# Altium project Automated Plant Watering System.PrjPcb
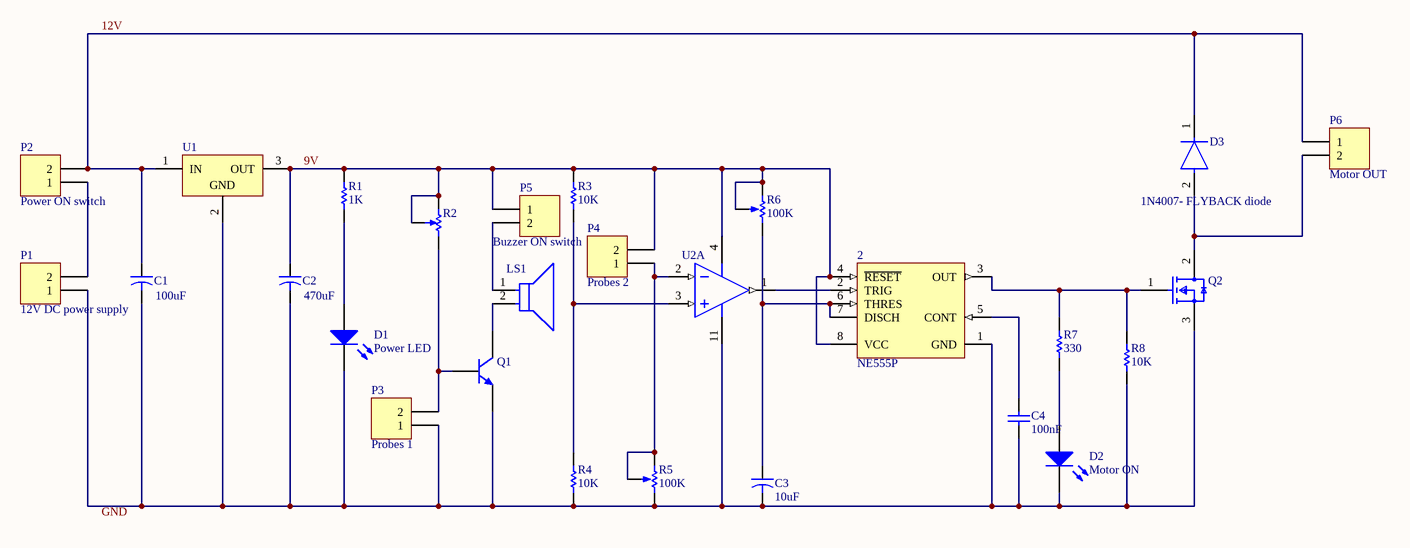
[diagram p0: Automated Plant Watering System Schematic.SchDoc]
1 sheet, 27 parts. Net scope: global (net labels, ports and power ports of the same name join across sheets).
Board file: Automated Plant Watering PCB.PcbDoc

## Sheet Automated Plant Watering System Schematic.SchDoc: Automated Plant Watering System
size A4; SheetNumber: 1; SheetTotal: 1; SPICEModelCacheCQLGJPCW: <root> / <DocumentId>CQLGJPCW</DocumentId> / <CacheFrame Number="0"> / <Model Name="led1" Kind="MDL"> / <Text>*Typ RED GaAs LED: Vf=1.7V Vr=4V If=40mA trr=3uS / *LED Pinout: 1=A, 2=K / .MODEL LED1 D (IS=93.2P RS=42M N=3.73 BV=4 IBV=10U / + CJO=2.97P VJ=.75 M=.333 TT=4.32U)</Text> / </Model> / <Model Name="npn" Kind="MDL"> / <Text>*Default NPN BJT / *NPN Trans Pinout: C,B,E / .MODEL NPN NPN()</Text> / </Model> / </CacheFrame> / </root>

### Parts
2  NE555P  [P0008A]
C1  100uF  [CAPR5-4X5]
C2  470uF  [CAPR5-4X5]
C3  10uF  [CAPR5-4X5]
C4  100nF  [RAD-0.3]
D1  Power LED  [LED-1]
D2  Motor ON  [LED-1]
D3  1N4007- FLYBACK diode  [FP-1N4007-MFG]
LS1  AI-1223-TWT-5V-R  [FP-AI-1223-TWT-5V-R-MFG]  (value not drawn)
P1  12V DC power supply  [HDR1X2]
P2  Power ON switch  [HDR1X2]
P3  Probes 1  [HDR1X2]
P4  Probes 2  [HDR1X2]
P5  Buzzer ON switch  [HDR1X2]
P6  Motor OUT  [HDR1X2]
Q1  NPN  [TO-226-AA]  (value not drawn)
Q2  FQP30N06  [FP-340AT-MFG]  (value not drawn)
R1  1K  [AXIAL-0.3]
R2  93PR1KLF  [BIT-93PR1KLF]  (value not drawn)
R3  10K  [AXIAL-0.3]
R4  10K  [AXIAL-0.3]
R5  100K  [VR5]
R6  100K  [VR5]
R7  330  [AXIAL-0.3]
R8  10K  [AXIAL-0.3]
U1  L7809CV  [TO220]  (value not drawn)
U2  LM324AN  [N0014A]  (value not drawn)  (part A of 4)

### Nets
9V: 2.4(~{RESET}) 2.8(VCC) C2.1 P4.2 P5.1 R1.2 R2.1 R2.2 R3.2 R6.1(TOP) R6.3(TAP) U1.3(OUT) U2.4(V+)
12V: C1.1 D3.1(C) P2.2 P6.1 U1.1(IN)
Net2_1: 2.1(GND) C1.2 C2.2 C3.2 C4.1 D1.2(K) D2.2(K) P1.1 P3.1 Q1.3(E) Q2.3(S) R4.1 R5.2(BOT) R8.1 U1.2(GND) U2.11(GND)
Net2_2: 2.2(TRIG) U2.1(OUT1)
Net2_3: 2.3(OUT) Q2.1(G) R7.2 R8.2
Net2_5: 2.5(CONT) C4.2
Net2_6: 2.6(THRES) 2.7(DISCH) C3.1 R6.2(BOT)
NetD1_1: D1.1(A) R1.1
NetD2_1: D2.1(A) R7.1
NetD3_2: D3.2(A) P6.2 Q2.2(D)
NetLS1_1: LS1.1(C) P5.2
NetLS1_2: LS1.2(A) Q1.1(C)
NetP1_2: P1.2 P2.1
NetP3_2: P3.2 Q1.2(B) R2.3
NetP4_1: P4.1 R5.1(TOP) R5.3(TAP) U2.2(IN1-)
NetR3_1: R3.1 R4.2 U2.3(IN1+)

### Notes on the sheet
- Labels drawn without touching a wire or pin: GND

### Library data of the parts
2 = CMP-001-0003-1: IC OSC SINGLE TIMER 100KHZ 8-DIP
C1-C3 = Cap2: Capacitor; Published: 23-Sep-2002; PackageReference: CAPR5-4X5; Publisher: Altium Limited; PackageDescription: Capacitor; 2 Leads
  C1: Value: 100uF
  C2: Value: 470uF
  C3: Value: 10uF
C4 = Cap: Capacitor; Published: 8-Jun-2000; LatestRevisionDate: 17-Jul-2002; LatestRevisionNote: Re-released for DXP Platform.; PackageReference: RAD-0.3; Publisher: Altium Limited; PackageDescription: Radial Cap, Thru-Hole; 2 Leads; 0.3 in Pin Spacing; Value: 100nF
D1 D2 = LED1: Typical RED GaAs LED; Published: 8-Jun-2000; LatestRevisionDate: 08-Jul-2005; LatestRevisionNote: Mech Layer 1 removed.; PackageReference: LED-1; Publisher: Altium Limited; PackageDescription: LED; 2 Leads
D3 = CMP-02540-000046-1: DIODE GEN PURP 1KV 1A DO204AL; Manufacturer: Vishay; Manufacturer Part Number: 1N4007-E3/54; Value: 15pF; Max Junction Temp: +150°C; Max Surge Forward Current: 30A; Max Repetitive Reverse Voltage: 1000V; Peak Reverse Current: 30uA; Octopart: https://octopart.com/1n4007-e3%2F54-vishay-39548207; Digikey Description: DIODE GEN PURP 1KV 1A DO204AL; Category: Diode; Mouser Description: Rectifiers Vr/1000V Io/1A; Automotive: No; Package: 1N4007; Device Class L3: Rectifier Diodes; Temperature Range High: +150°C; Capacitance: 15pF; Ipc Land Pattern Name: DIOPA1088W105L520D270; Lead Free: Yes; ComponentLink2Description: Datasheet; Forward Current: 1A; Device Class L1: Discrete Semiconductors; ComponentLink2URL: http://www.vishay.com/docs/88503/1n4001.pdf; Temperature Range Low: -50°C; Height: 2.7mm; RoHS: TRUE; Temperature: -50°C to +150°C; Device Class L2: Diodes
LS1 = CMP-231724-000001-1: AUDIO MAGNETIC INDICATOR 3-7V TH; Input Type: DC; Bandwidth: 2.3kHz; Nominal Supply Voltage (DC): 5V; Max Supply Current: 30mA; Washable: Yes; Max Supply Voltage (DC): 7V; Min Supply Voltage: 3V; Series: AI; Width: 12mm; REACH SVHC: No SVHC; Contact Plating: Tin; Frequency: 2.3kHz; Operating Supply Current: 30mA; Weight: 0.01lb; Current Rating: 30mA; Mount: Through Hole; Packaging: Tray; Length: 12mm; Lead Free: Lead Free; Color: Black; Input Current: 30mA; Min Operating Temperature: -40°C; Self Resonant Frequency: 2.3kHz; Sensing Method: Magnetic; Voltage Rating (DC): 5V; Height: 9.5mm; Termination: PC Pins; Min Supply Voltage (DC): 3V; Package Quantity: 100; Max Supply Voltage: 7V; Diameter: 12mm; Max Operating Temperature: 85°C
P1-P6 = Header 2: Header, 2-Pin; LatestRevisionDate: 17-Jul-2002; LatestRevisionNote: Re-released for DXP Platform.; Publisher: Altium Limited
Q1 = NPN: NPN Bipolar Transistor; Published: 8-Jun-2000; LatestRevisionDate: 17-Jul-2002; LatestRevisionNote: Re-released for DXP Platform.; PackageReference: TO-226-AA; Publisher: Altium Limited; PackageDescription: TO, Flat Index; 3 In-Line, Axial Leads; Body Dia. 4.8mm; Leads 0.55 x 0.51 mm (max); Code_JEDEC: TO-226-AA
Q2 = CMP-013-00037-1: Power MOSFET, N-Channel, QFET®, 60 V, 30 A, 40 mΩ, TO-220
R1 R3 R4 R7 R8 = Res1: Resistor; Published: 8-Jun-2000; LatestRevisionDate: 17-Jul-2002; LatestRevisionNote: Re-released for DXP Platform.; PackageReference: AXIAL-0.3; Publisher: Altium Limited; PackageDescription: Axial Device, Thru-Hole; 2 Leads; 0.3 in Pin Spacing
  R1: Value: 1K
  R3 R4 R8: Value: 10K
  R7: Value: 330
R2 = CMP-2000-05711-1: 1/2” Diameter Single Turn Cermet Trimming Potentiometer, 1 KOhm, -55 to 125 degC, 3-Pin THD, RoHS, Bulk; Manufacturer: BI Technologies; Product Diameter (mm): 12.7mm; Shaft Diameter (mm): 6.35mm; Rad Hardened: No; Resistance: 1000ohm; Product Length (mm): NotRequiredmm; Temperature Coefficient: ?100ppm/?C; Tolerance (+ or -): 10%; DELETED: Compliant; Number of Turns: 1Turn; Power Rating: 1W; Mounting Technology: ThroughHole; Product Height (mm): 6.35mm; Failure Rate: NotRequired; Datasheet Version: 12/2012; Operating Temp Range: -55Cto125C; Type: Trimmer; Manufacturer URL: http://www.bi-technologies.net/; Termination Style: Pin; Technology: Cermet; Datasheet URL: https://datasheet.ciiva.com/15760/93-15760960.pdf; Product Depth (mm): NotRequiredmm; Mounting Style: ThroughHole; Package Reference: 93PR1KLF; Package Description: 3-Pin Through Hole Device, Dia 12.7mm; Packaging: Box; Military Standard: NotRequired
R5 R6 = RPot: Potentiometer; Sim Note: Enter the Resistance value and the set point into parameter fields.; Set Position: 0.5; Published: 8-Jun-2000; LatestRevisionDate: 17-Jul-2002; LatestRevisionNote: Re-released for DXP Platform.; PackageReference: VR5; Publisher: Altium Limited; PackageDescription: Variable Resistor, Thru-Hole; 3 Leads; Value: 100K
U1 = CMP-001-0002-1: IC REG LDO 9V 1.5A TO220AB
U2 = CMP-001-0000-1: Quadruple improved offset operational amplifier 14-PDIP 0 to 70